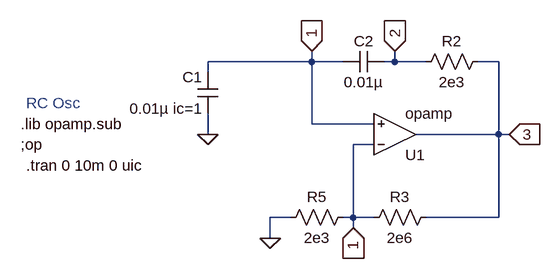
[diagram p0: schematic RC 0sc#2.asc]
RC 0sc#2.asc, the LTspice schematic file:
Version 4
SHEET 1 880 680
WIRE 256 -16 256 -32
WIRE 256 -16 96 -16
WIRE 304 -16 256 -16
WIRE 384 -16 384 -32
WIRE 384 -16 368 -16
WIRE 432 -16 384 -16
WIRE 544 -16 512 -16
WIRE 96 0 96 -16
WIRE 256 80 256 -16
WIRE 352 80 256 80
WIRE 96 96 96 64
WIRE 544 96 544 -16
WIRE 544 96 416 96
WIRE 560 96 544 96
WIRE 352 112 320 112
WIRE 224 224 192 224
WIRE 320 224 320 112
WIRE 320 224 304 224
WIRE 352 224 320 224
WIRE 544 224 544 96
WIRE 544 224 432 224
WIRE 320 240 320 224
WIRE 192 256 192 224
FLAG 192 256 0
FLAG 96 96 0
FLAG 256 -32 1
IOPIN 256 -32 In
FLAG 384 -32 2
IOPIN 384 -32 In
FLAG 560 96 3
IOPIN 560 96 In
FLAG 320 240 1
IOPIN 320 240 In
SYMBOL OpAmps\\opamp 384 160 M180
SYMATTR InstName U1
SYMBOL res 528 -32 R90
WINDOW 0 0 56 VBottom 2
WINDOW 3 32 56 VTop 2
SYMATTR InstName R2
SYMATTR Value 2e3
SYMBOL res 208 240 R270
WINDOW 0 32 56 VTop 2
WINDOW 3 0 56 VBottom 2
SYMATTR InstName R5
SYMATTR Value 2e3
SYMBOL res 336 240 R270
WINDOW 0 32 56 VTop 2
WINDOW 3 0 56 VBottom 2
SYMATTR InstName R3
SYMATTR Value 2e6
SYMBOL cap 368 -32 R90
WINDOW 0 0 32 VBottom 2
WINDOW 3 32 32 VTop 2
SYMATTR InstName C2
SYMATTR Value 0.01µ
SYMBOL cap 112 64 R180
WINDOW 0 24 56 Left 2
WINDOW 3 24 8 Left 2
SYMATTR InstName C1
SYMATTR Value 0.01µ ic=1
TEXT -192 80 Left 2 !.lib opamp.sub
TEXT -192 112 Left 2 !;op
TEXT -184 48 Left 2 ;RC Osc
TEXT -184 144 Left 2 !.tran 0 10m 0 uic

The netlist it stands for:
* RC 0sc#2.asc
XU1 1 1 3 opamp Aol=100K GBW=10Meg  ; pins invin noninvin out
R2 3 2 2e3
R5 0 1 2e3
R3 1 3 2e6
C2 2 1 0.01µ
C1 0 1 0.01µ ic=1
.lib opamp.sub
;op
* RC Osc
.tran 0 10m 0 uic
.backanno
.end